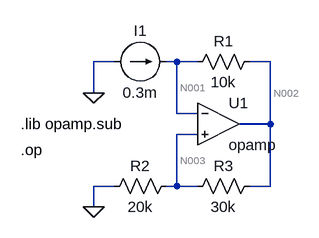
[diagram p0: schematic pag7es13p1.asc]
pag7es13p1.asc, the LTspice schematic file:
Version 4
SHEET 1 880 680
WIRE 128 48 96 48
WIRE 224 48 208 48
WIRE 256 48 224 48
WIRE 368 48 336 48
WIRE 96 96 96 48
WIRE 224 128 224 48
WIRE 256 128 224 128
WIRE 368 144 368 48
WIRE 368 144 320 144
WIRE 256 160 224 160
WIRE 128 240 96 240
WIRE 224 240 224 160
WIRE 224 240 208 240
WIRE 256 240 224 240
WIRE 368 240 368 144
WIRE 368 240 336 240
WIRE 96 272 96 240
FLAG 96 272 0
FLAG 96 96 0
SYMBOL res 224 224 R90
WINDOW 0 0 56 VBottom 2
WINDOW 3 32 56 VTop 2
SYMATTR InstName R2
SYMATTR Value 20k
SYMBOL res 352 224 R90
WINDOW 0 0 56 VBottom 2
WINDOW 3 32 56 VTop 2
SYMATTR InstName R3
SYMATTR Value 30k
SYMBOL res 240 64 R270
WINDOW 0 32 56 VTop 2
WINDOW 3 0 56 VBottom 2
SYMATTR InstName R1
SYMATTR Value 10k
SYMBOL current 128 48 R270
WINDOW 0 32 40 VTop 2
WINDOW 3 -32 40 VBottom 2
SYMATTR InstName I1
SYMATTR Value 0.3m
SYMBOL OpAmps\\opamp 288 80 R0
SYMATTR InstName U1
TEXT -16 144 Left 2 !.lib opamp.sub
TEXT -16 184 Left 2 !.op

The netlist it stands for:
* pag7es13p1.asc
R2 N003 0 20k
R3 N002 N003 30k
R1 N001 N002 10k
I1 0 N001 0.3m
XU1 N001 N003 N002 opamp Aol=100K GBW=10Meg  ; pins invin noninvin out
.lib opamp.sub
.op
.backanno
.end

* Results of the author's LTspice run, read from the files saved beside the schematic
* Operating Point:
*   V(n003) = -2 V
*   V(n002) = -5 V
*   V(n001) = -2 V
*   I(I1) = 300 µA
*   I(R1) = 300 µA
*   I(R3) = -100 µA
*   I(R2) = -100 µA
*   Ix(u1:3) = 400 µA